# EAGLE design attinier84-motherboard-mk-1.1 (EAGLE 6.5.0)
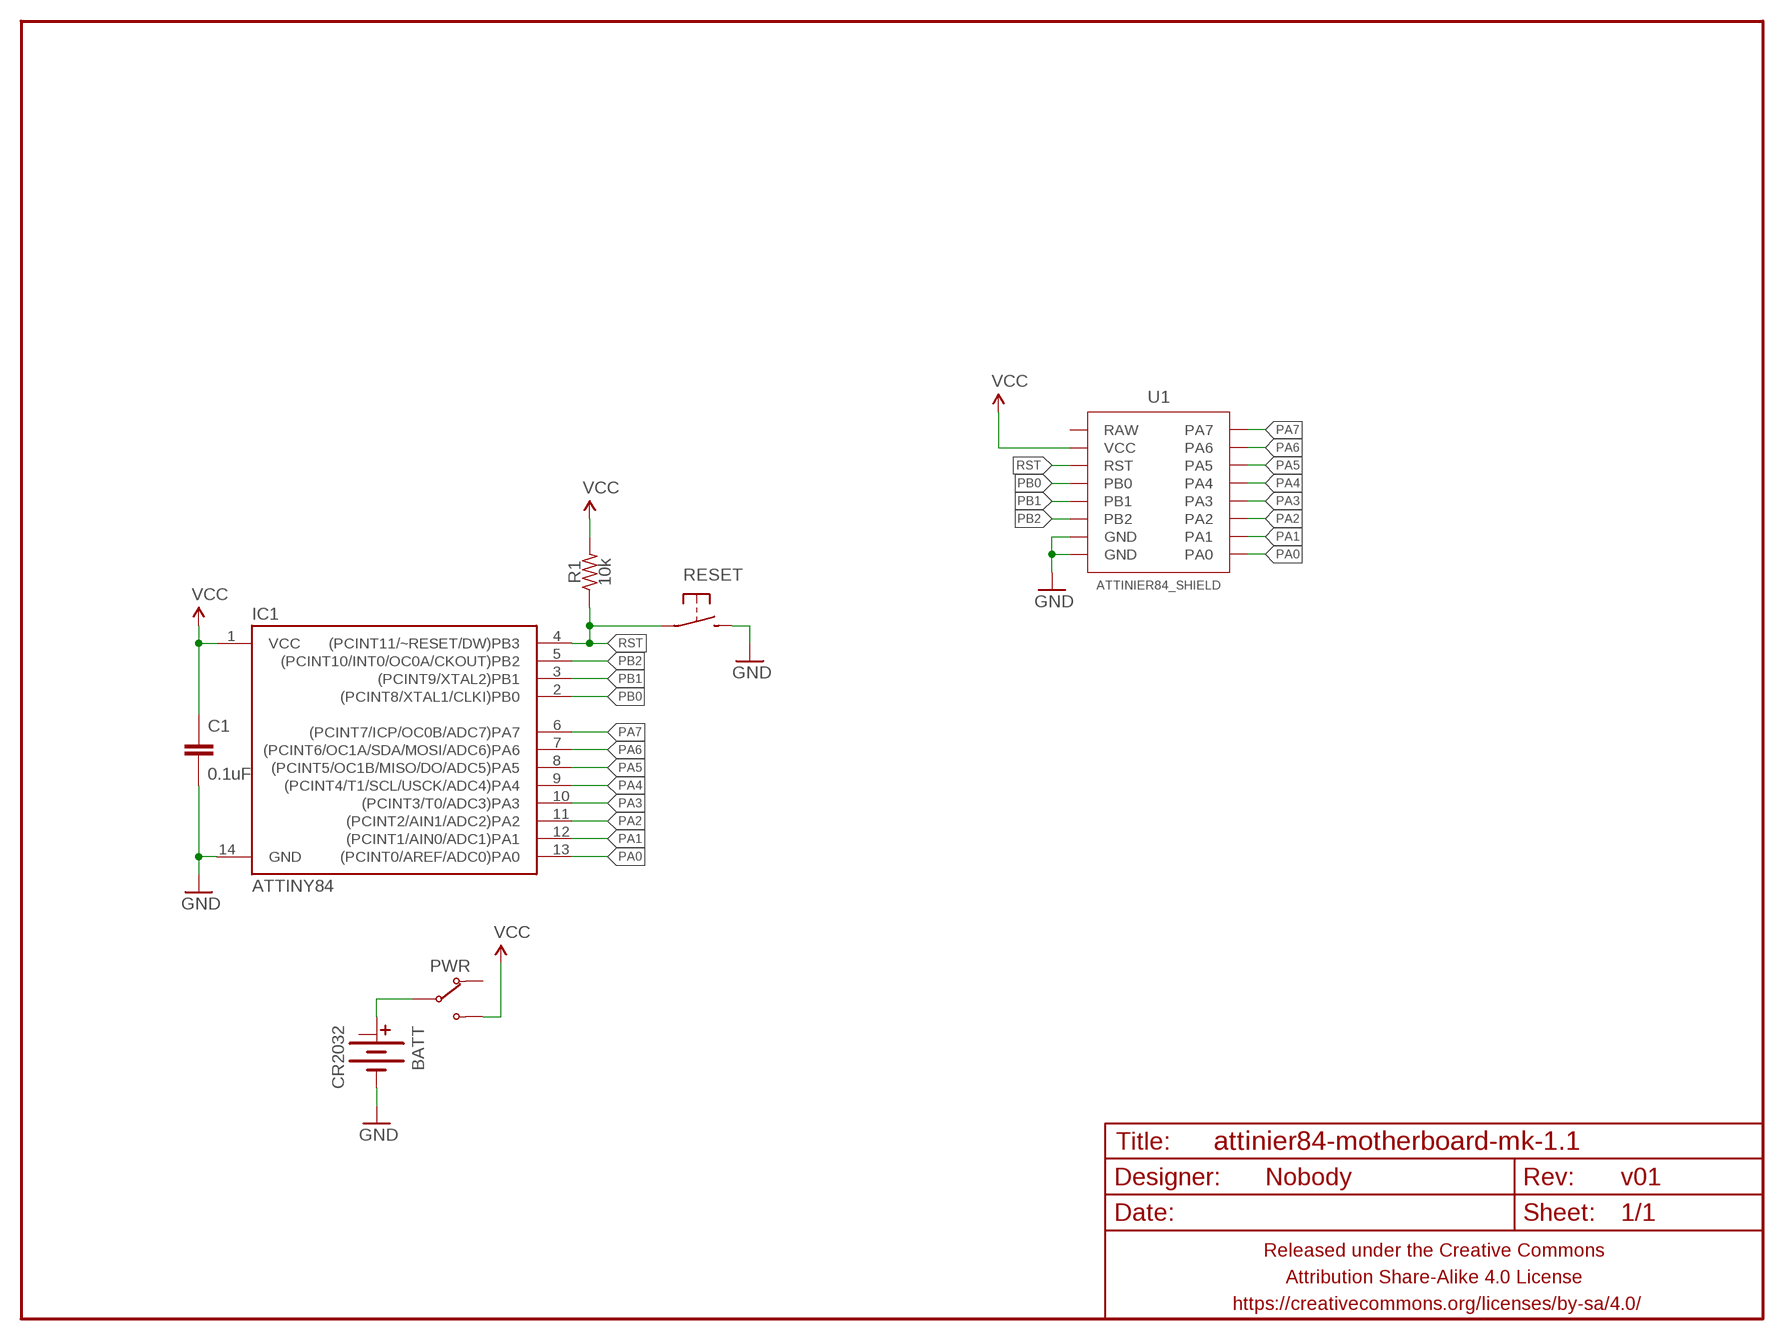
[diagram p0: schematic, sheet 1]

## Parts
BATT  CR2032  BATTERY-COINCR2032_SMD  [BATTCON_20MM_MINE]
C1  0.1uF  CAPACITOR-CERAMICC0805  [C0805]
FRAME1  FRAME-LETTERNO_PACKAGE  [DUMMY]
IC1  ATTINY84  [SO14]
PWR  SWITCH-SPDTSMD-RA  [SWITCH-SPDT-SMD-RA]
R1  10k  RESISTORR0805  [R0805]
RESET  SPST-NO-TACT6MM-SMD  [DTSM-6]
U1  ATTINIER84_SHIELD  [ATTINIER84_SHIELD]

## Nets
GND: BATT.BOTTOM(-) C1.2 IC1.14(GND) RESET.3 RESET.4 U1.GND@1(GND) U1.GND@2(GND)
N$1: BATT.TOP@1(+) PWR.2(COM)
PA0: IC1.13((PCINT0/AREF/ADC0)PA0) U1.PA0
PA1: IC1.12((PCINT1/AIN0/ADC1)PA1) U1.PA1
PA2: IC1.11((PCINT2/AIN1/ADC2)PA2) U1.PA2
PA3: IC1.10((PCINT3/T0/ADC3)PA3) U1.PA3
PA4: IC1.9((PCINT4/T1/SCL/USCK/ADC4)PA4) U1.PA4
PA5: IC1.8((PCINT5/OC1B/MISO/DO/ADC5)PA5) U1.PA5
PA6: IC1.7((PCINT6/OC1A/SDA/MOSI/ADC6)PA6) U1.PA6
PA7: IC1.6((PCINT7/ICP/OC0B/ADC7)PA7) U1.PA7
PB0: IC1.2((PCINT8/XTAL1/CLKI)PB0) U1.PB0
PB1: IC1.3((PCINT9/XTAL2)PB1) U1.PB1
PB2: IC1.5((PCINT10/INT0/OC0A/CKOUT)PB2) U1.PB2
RST: IC1.4((PCINT11/~RESET/DW)PB3) R1.1 RESET.1 RESET.2 U1.RST
VCC: C1.1 IC1.1(VCC) PWR.1(NO) R1.2 U1.VCC
Unconnected: BATT.TOP@2(+1) PWR.3(NC) U1.RAW

## Library data of the parts
BATT = A_butts:BATTERY-COIN
C1 = A_butts:CAPACITOR-CERAMIC: CAPACITOR, European symbol
FRAME1 = A_butts:FRAME-LETTER: Schematic Frame Standard 8.5x11 US Letter frame; DESIGNER: Nobody; VERSION: v01
IC1 = A_butts:ATTINY84: Atmel 14-pin 2/4/8kB flash uC
PWR = A_butts:SWITCH-SPDT
R1 = A_butts:RESISTOR: RESISTOR, American symbol
RESET = A_butts:SPST-NO-TACT
U1 = A_butts:ATTINIER84_SHIELD

## Board
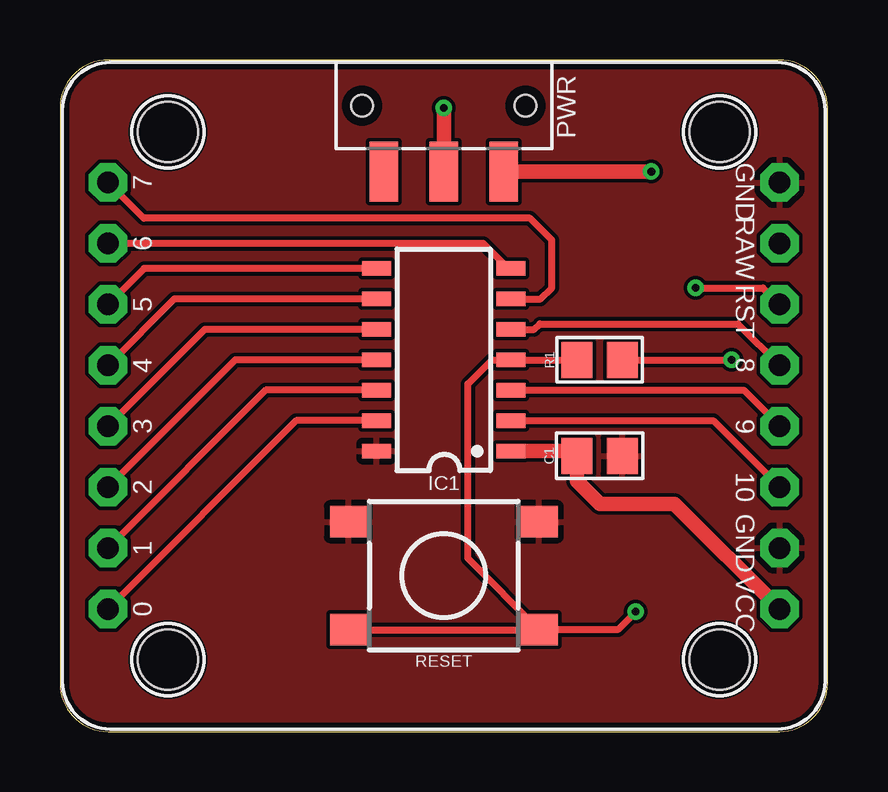
[diagram p1: board, top side]
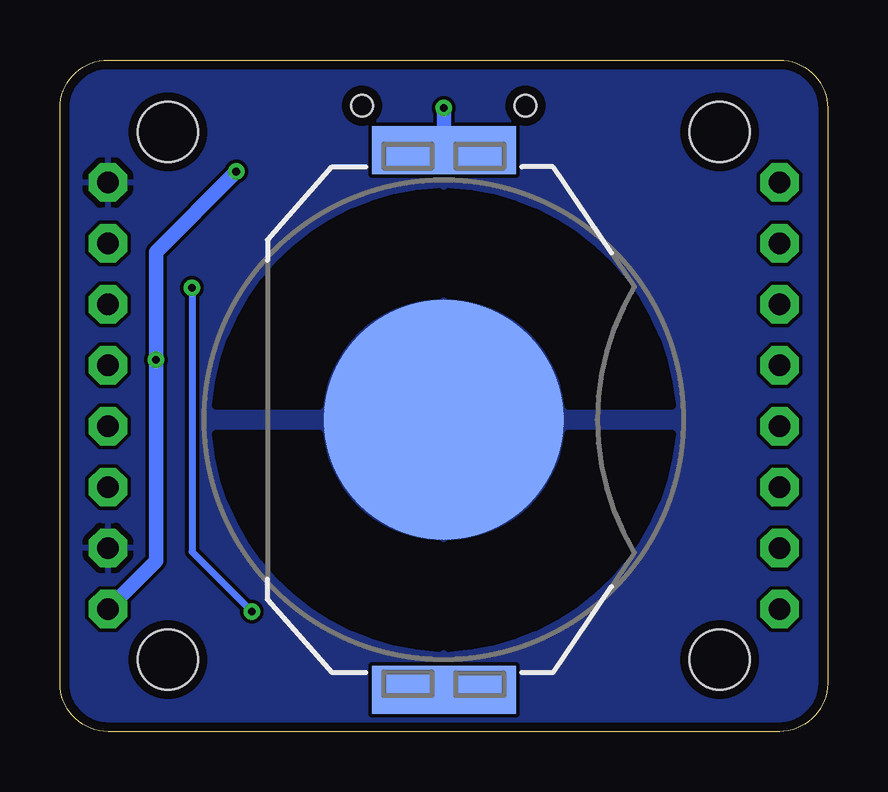
[diagram p2: board, bottom side, seen from below]

Size 32 x 28 mm. Coordinates in mm from the lower left corner, seen from the top.
Outline: 0,26 0,2 arc90 2,0 30,0 arc90 32,2 32,26 arc90 30,28 2,28 arc90 0,26
Copper layers (1*16): Top 0.0356mm / dielectric 1.5011mm / Bottom 0.0356mm
Design rules "LaenPCBOrder_2": minimum track width 6mil, minimum drill 13mil, track to track 6mil, track to pad 6mil, pad to pad 6mil, via to via 6mil, smd to smd 6mil, copper to edge 15mil, drill to drill 6mil, minimum pad ring 7mil, minimum via ring 7mil, stop-mask expansion 3mil, vias tented up to drill 20mil, thermal gap 10mil
Holes 2.5 mm at 4.5,25 27.5,25 27.5,3 4.5,3

### Footprints (pad centres in the part's own frame; a part is rotated, then mirrored left to right if it is on the bottom)
BATTCON_20MM_MINE = smd 10 x 10: BOTTOM 0,0 | smd 6 x 2: TOP@1 0,11.25; TOP@2 0,-11.25
C0805 = smd 1.3 x 1.5: 1 -0.95,0; 2 0.95,0
SO14 = smd 0.6 x 1.2: 1 -3.81,-2.8; 2 -2.54,-2.8; 3 -1.27,-2.8; 4 0,-2.8; 5 1.27,-2.8; 6 2.54,-2.8; 7 3.81,-2.8; 8 3.81,2.8; 9 2.54,2.8; 10 1.27,2.8; 11 0,2.8; 12 -1.27,2.8; 13 -2.54,2.8; 14 -3.81,2.8
SWITCH-SPDT-SMD-RA = smd 1.2 x 2.5: 1 -2.5,0; 2 0,0; 3 2.5,0 | hole 0.9: -3.4,-2.75; 3.4,-2.75
R0805 = smd 1.3 x 1.5: 1 -0.95,0; 2 0.95,0
DTSM-6 = smd 1.55 x 1.3: 1 -3.975,2.25; 2 3.975,2.25; 3 -3.975,-2.25; 4 3.975,-2.25
ATTINIER84_SHIELD = drill 0.9 pad 1.6 octagon: GND@1 14,-6.35; GND@2 14,8.89; PA0 -14,-8.89; PA1 -14,-6.35; PA2 -14,-3.81; PA3 -14,-1.27; PA4 -14,1.27; PA5 -14,3.81; PA6 -14,6.35; PA7 -14,8.89; PB0 14,-3.81; PB1 14,-1.27; PB2 14,1.27; RAW 14,6.35; RST 14,3.81; VCC 14,-8.89

### Placement (x,y rotation side)
BATT  16,13 0 bottom
C1  22.5,11.5 0 top
FRAME1  0,0 0 top
IC1  16,15.5 90 top
PWR  16,23.35 180 top
R1  22.5,15.5 0 top
RESET  16,6.5 180 top
U1  16,14 0 top

### Tracks (layer width: path | path; a pad name or v marks a point on that pad's centre or on a via)
GND
  pour Bottom: -0.1,-0.1 -0.1,28.1 32.1,28.1 32.1,-0.1
  pour Top: -0.1,-0.1 -0.1,28.1 32.1,28.1 32.1,-0.1
N$1  (via drill 0.33)
  Top 0.6: v16,26 PWR.2
  Bottom 0.6: BATT.TOP@1 v16,26
PA0
  Top 0.3: IC1.13 9.85,12.96 U1.PA0
PA1
  Top 0.3: IC1.12 8.58,14.23 U1.PA1
PA2
  Top 0.3: IC1.11 7.31,15.5 U1.PA2
PA3
  Top 0.3: IC1.10 6.04,16.77 U1.PA3
PA4
  Top 0.3: IC1.9 4.77,18.04 U1.PA4
PA5
  Top 0.3: IC1.8 3.5,19.31 U1.PA5
PA6
  Top 0.3: IC1.7 18.69,19.31 17.65,20.35 U1.PA6
PA7
  Top 0.3: IC1.6 20.04,18.04 20.5,18.5 20.5,20.5 19.6,21.4 3.49,21.4 U1.PA7
PB0
  Top 0.3: IC1.2 27.23,12.96 U1.PB0
PB1
  Top 0.3: IC1.3 28.5,14.23 U1.PB1
PB2
  Top 0.3: IC1.5 19.77,16.77 20,17 28.27,17 U1.PB2
RST  (via drill 0.33)
  Top 0.3: R1.1 IC1.4 18,15.5 17,14.5 17,7.22 RESET.1 | RESET.2 RESET.1 | v24,5 23.25,4.25 RESET.1 | v26.5,18.5 29.31,18.5 U1.RST
  Bottom 0.3: v26.5,18.5 26.5,7.5 v24,5
VCC  (via drill 0.33)
  Top 0.3: R1.2 v28,15.5
  Top 0.6: U1.VCC 25.61,9.5 22.5,9.5 21.55,10.45 C1.1 21.36,11.69 IC1.1 | v24.65,23.35 PWR.1
  Bottom 0.6: v24.65,23.35 28,20 v28,15.5 28,7.11 U1.VCC